# EAGLE design ANA_MCU_CC1310 (EAGLE 8.5.1)
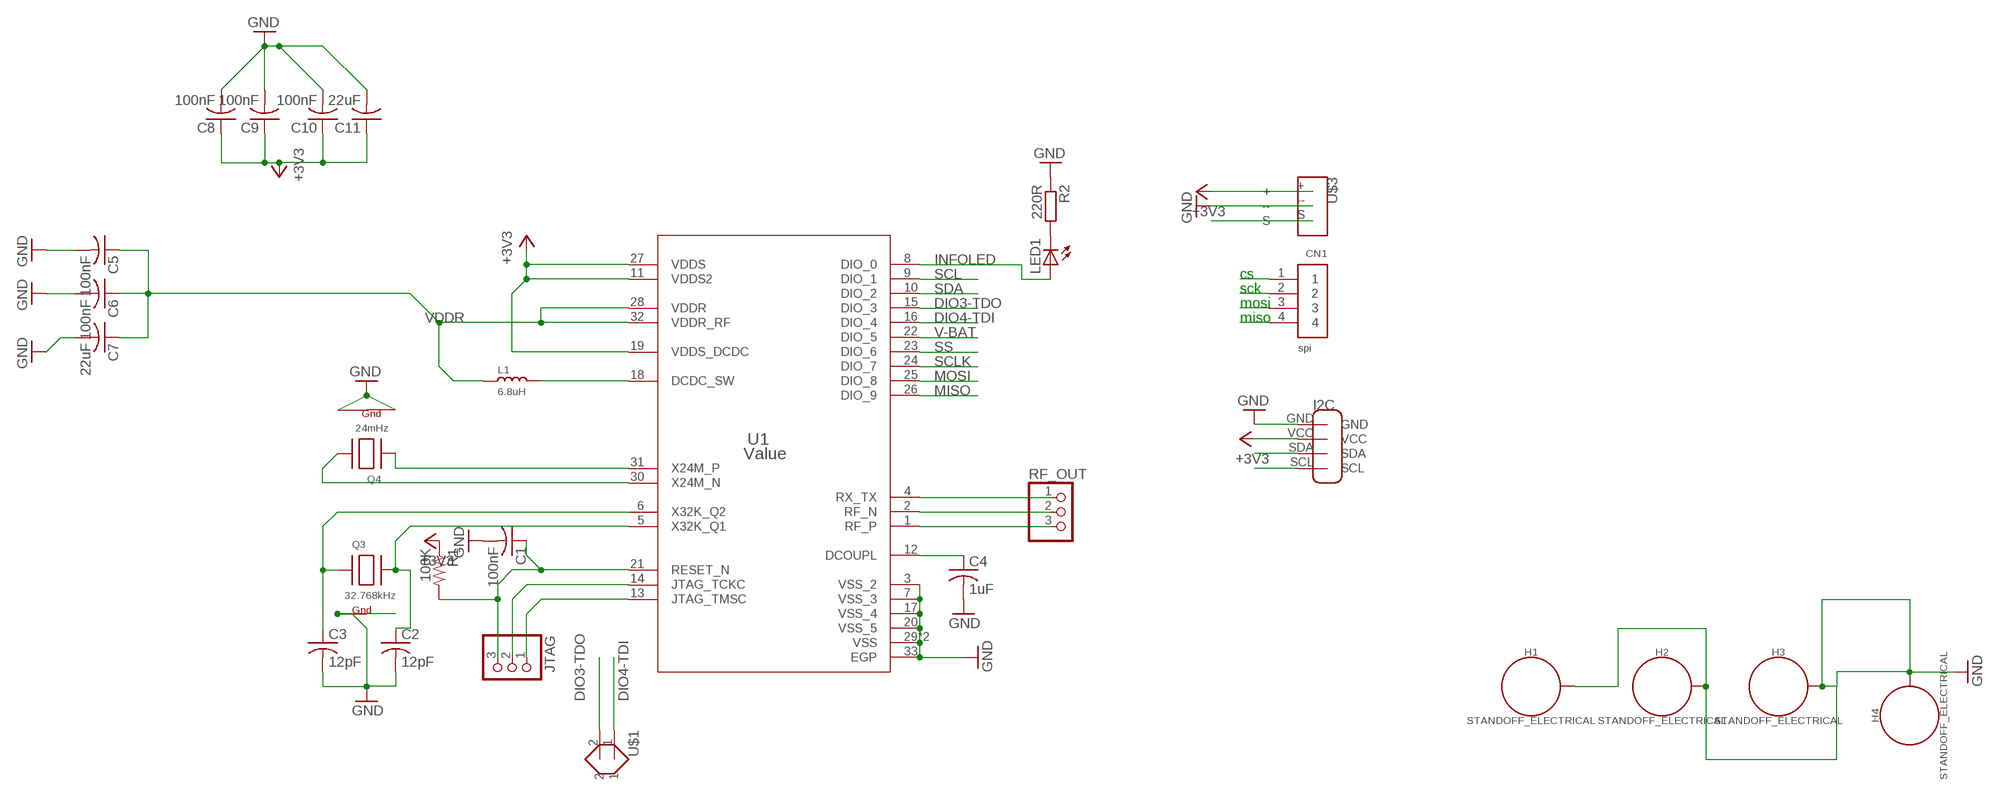
[diagram p0: schematic, sheet 1]

## Parts
C1  100nF  C-USC0805K  [C0805K]
C2  12pF  C-USC0805K  [C0805K]
C3  12pF  C-USC0805K  [C0805K]
C4  1uF  C-USC0805K  [C0805K]
C5  100nF  C-USC0805K  [C0805K]
C6  100nF  C-USC0805K  [C0805K]
C7  22uF  C-USC0805K  [C0805K]
C8  100nF  C-USC0805K  [C0805K]
C9  100nF  C-USC0805K  [C0805K]
C10  100nF  C-USC0805K  [C0805K]
C11  22uF  C-USC0805K  [C0805K]
CN1  spi  1X4-CLEANBIG  [1X04-CLEANBIG]
H1  STANDOFF_ELECTRICAL  [STANDOFF-ELECTRICAL]
H2  STANDOFF_ELECTRICAL  [STANDOFF-ELECTRICAL]
H3  STANDOFF_ELECTRICAL  [STANDOFF-ELECTRICAL]
H4  STANDOFF_ELECTRICAL  [STANDOFF-ELECTRICAL]
JTAG  PINHD-1X3CB  [1X03-CLEANBIG]
L1  6.8uH  SMD-FERRITE-BEAD-330R-1500MA(0805)'0805'  [L0805]
LED1  LEDCHIP-LED0805  [CHIP-LED0805]
Q3  32.768kHz  XTAL-4-3225  [NX3225]
Q4  24mHz  XTAL-4-3225  [NX3225]
R1  100K  R-US_R0805  [R0805]
R2  220R  R-EU_R0805  [R0805]
RF_OUT  PINHD-1X3CB  [1X03-CLEANBIG]
U1  Value  CC1310F128RSMR  [RSM0032B]
U$1  DCMOTOR  [DCMOTOR]
U$2  I2C  [I2C]
U$3  3PINSENSOR  [3PINSENSOR]

## Nets
+3V3: C8.1 C9.1 C10.1 C11.1 R1.1 U1.11(VDDS2) U1.19(VDDS_DCDC) U1.27(VDDS) U$2.VCC U$3.+
DIO3-TDO: U1.15(DIO_3) U$1.2
DIO4-TDI: U1.16(DIO_4) U$1.1
GND: C1.2 C2.2 C3.2 C4.2 C5.2 C6.2 C7.2 C8.2 C9.2 C10.2 C11.2 H1.P1 H2.P1 H3.P1 H4.P1 Q3.2(G2) Q3.4(G1) Q4.2(G2) Q4.4(G1) R2.1 U1.3(VSS_2) U1.7(VSS_3) U1.17(VSS_4) U1.20(VSS_5) U1.29(VSS) U1.33(EGP) U1.V(VSS) U$2.GND U$3.--
INFOLED: LED1.A U1.8(DIO_0)
MISO: CN1.4 U1.26(DIO_9)
MOSI: CN1.3 U1.25(DIO_8)
N$1: Q4.3(X2) U1.30(X24M_N)
N$2: C3.1 Q3.1(X1) U1.6(X32K_Q2)
N$3: Q4.1(X1) U1.31(X24M_P)
N$4: LED1.C R2.2
N$6: L1.2 U1.18(DCDC_SW)
N$10: C2.1 Q3.3(X2) U1.5(X32K_Q1)
N$11: C1.1 JTAG.3 R1.2 U1.21(RESET_N)
N$12: JTAG.2 U1.14(JTAG_TCKC)
N$13: JTAG.1 U1.13(JTAG_TMSC)
N$15: C4.1 U1.12(DCOUPL)
N$16: RF_OUT.3 U1.1(RF_P)
N$17: RF_OUT.2 U1.2(RF_N)
N$18: RF_OUT.1 U1.4(RX_TX)
SCL: U1.9(DIO_1) U$2.SCL
SCLK: CN1.2 U1.24(DIO_7)
SDA: U1.10(DIO_2) U$2.SDA
SS: CN1.1 U1.23(DIO_6)
V-BAT: U1.22(DIO_5) U$3.S
VDDR: C5.1 C6.1 C7.1 L1.1 U1.28(VDDR) U1.32(VDDR_RF)

## Notes on the sheet
- cs
- sck
- mosi
- miso

## Library data of the parts
C1-C11 = adafruit:C-US: CAPACITOR, American symbol
CN1 = adafruit:1X4: 4-pin connector
H1-H4 = SparkFun-Hardware:STANDOFF_ELECTRICAL: Stand Off Drill holes with an electrical connection. For example, use these to ground your board to a chassis. Example SparkFun Products Screw - Phillips Head (1/4", 4-40, 10 pack) <https://www.sparkfun.com/products/10453> (PRT-10453) Screw - Phillips Head (1/2", 4-40, 10 pack) <https://www.sparkfun.com/products/10452> (PRT-10452) Screw - Phillips Head (3/4", 4-40, 10 pack) <https://www.sparkfun.com/products/10451> (PRT-10451) Screw - Phillips Head (1", 4-40, 10 pack) <https://www.sparkfun.com/products/10450> (PRT-10450)
JTAG RF_OUT = adafruit:PINHD-1X3: PIN HEADER
L1 = Seeed-Inductor:SMD-FERRITE-BEAD-330R-1500MA(0805): 303030006; MPN: BLM21PG331SN1D; VALUE: 330R-1500MA
LED1 = adafruit:LED: LED OSRAM: - CHIPLED LG R971, LG N971, LY N971, LG Q971, LY Q971, LO R971, LY R971 LH N974, LH R974 LS Q976, LO Q976, LY Q976 LO Q996 - Hyper CHIPLED LW Q18S LB Q993, LB Q99A, LB R99A - SideLED LS A670, LO A670, LY A670, LG A670, LP A670 LB A673, LV A673, LT A673, LW A673 LH A674 LY A675 LS A676, LA A676, LO A676, LY A676, LW A676 LS A679, LY A679, LG A679 - Hyper Micro SIDELED® LS Y876, LA Y876, LO Y876, LY Y876 LT Y87S - SmartLED LW L88C, LW L88S LB L89C, LB L89S, LG L890 LS L89K, LO L89K, LY L89K LS L896, LA L896, LO L896, LY L896 - TOPLED LS T670, LO T670, LY T670, LG T670, LP T670 LSG T670, LSP T670, LSY T670, LOP T670, LYG T670 LG T671, LOG T671, LSG T671 LB T673, LV T673, LT T673, LW T673 LH T674 LS T676, LA T676, LO T676, LY T676, LB T676, LH T676, LSB T676, LW T676 LB T67C, LV T67C, LT T67C, LS T67K, LO T67K, LY T67K, LW E67C LS E67B, LA E67B, LO E67B, LY E67B, LB E67C, LV E67C, LT E67C LW T67C LS T679, LY T679, LG T679 LS T770, LO T770, LY T770, LG T770, LP T770 LB T773, LV T773, LT T773, LW T773 LH T774 LS E675, LA E675, LY E675, LS T675 LS T776, LA T776, LO T776, LY T776, LB T776 LHGB T686 LT T68C, LB T68C - Hyper Mini TOPLED® LB M676 - Mini TOPLED Santana® LG M470 LS M47K, LO M47K, LY M47K Source: http://www.osram.convergy.de/
Q3 Q4 = adafruit:XTAL-4: Classic 4-pin 3.2 x 2.5mm crystal
R1 = adafruit:R-US_: RESISTOR, American symbol
R2 = resistor:R-EU_: RESISTOR, European symbol
U1 = cc1310_4x4mm:CC1310F128RSMR; ALTERNATEPARTNUMBER: CC1310F128RSMT; APPLICATION_BUILDNUMBER: *; COMPTYPE: IC; MANUFACTURER: Texas Instruments; MOUNTTYPE: SMT; PACKAGEREFERENCE: RSM0032B; PARTNUMBER: CC1310F128RSMR; PIN_COUNT: 33; REFDES: RefDes; TYPE: TYPE
U$1 = 0000000111111aaa:DCMOTOR
U$2 = 0000000111111aaa:I2C
U$3 = 0000000111111aaa:3PINSENSOR

## Board
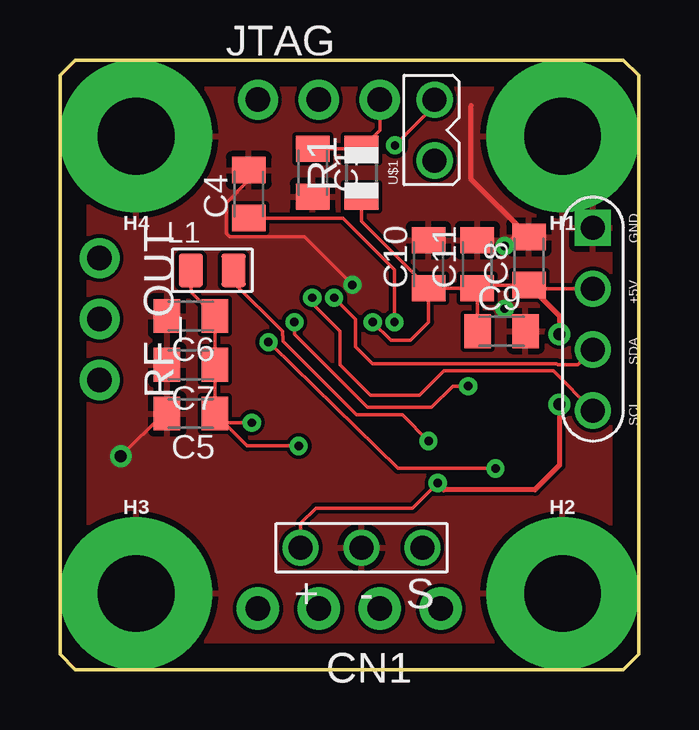
[diagram p1: board, top side]
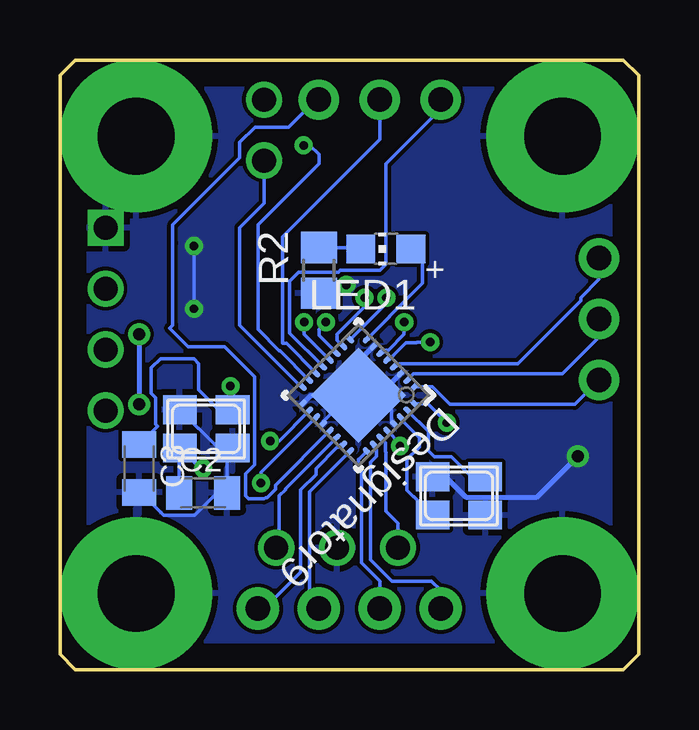
[diagram p2: board, bottom side, seen from below]

Size 24.13 x 25.4 mm. Coordinates in mm from the lower left corner, seen from the top.
Outline: 0.63,25.4 23.49,25.4 24.13,24.77 24.13,0.63 23.49,0 0.63,0 0,0.63 0,24.77 0.63,25.4
Copper layers (1*16): Top 0.035mm / dielectric 1.5mm / Bottom 0.035mm
Design rules "default": minimum track width 6mil, minimum drill 0.35mm, track to track 6mil, track to pad 6mil, pad to pad 6mil, via to via 6mil, smd to smd 6mil, copper to edge 40mil, drill to drill 6mil, minimum pad ring 10mil, minimum via ring 8mil, stop-mask expansion 4mil, vias tented up to drill 0mil, thermal gap 10mil

### Footprints (pad centres in the part's own frame; a part is rotated, then mirrored left to right if it is on the bottom)
C0805K = smd 1.1 x 1.4: 1 -1,0; 2 1,0
1X04-CLEANBIG = drill 1.016 pad 1.778: 1 -3.81,0; 2 -1.27,0; 3 1.27,0; 4 3.81,0
STANDOFF-ELECTRICAL = drill 3.2 pad 6.35: P1 0,0
1X03-CLEANBIG = drill 1.016 pad 1.676: 1 -2.54,0; 2 0,0; 3 2.54,0
L0805 = smd 1.016 x 1.397: 1 -0.889,0; 2 0.889,0
CHIP-LED0805 = smd 1.2 x 1.2: A 0,-1.05; C 0,1.05
NX3225 = smd 1.4 x 1.2: 1 -1.1,-0.8; 2 1.1,-0.8; 3 1.1,0.8; 4 -1.1,0.8
R0805 = smd 1.1 x 1.4: 1 -1,0; 2 1,0
R0805' = smd 1.3 x 1.5: 1 -0.95,0; 2 0.95,0
RSM0032B = smd 0.4 x 0.2: 1 -1.9,1.4; 2 -1.9,1; 3 -1.9,0.6; 4 -1.9,0.2; 5 -1.9,-0.2; 6 -1.9,-0.6; 7 -1.9,-1; 8 -1.9,-1.4; 17 1.9,-1.4; 18 1.9,-1; 19 1.9,-0.6; 20 1.9,-0.2; 21 1.9,0.2; 22 1.9,0.6; 23 1.9,1; 24 1.9,1.4 | smd 0.2 x 0.4: 9 -1.4,-1.9; 10 -1,-1.9; 11 -0.6,-1.9; 12 -0.2,-1.9; 13 0.2,-1.9; 14 0.6,-1.9; 15 1,-1.9; 16 1.4,-1.9; 25 1.4,1.9; 26 1,1.9; 27 0.6,1.9; 28 0.2,1.9; 29 -0.2,1.9; 30 -0.6,1.9; 31 -1,1.9; 32 -1.4,1.9 | smd 2.8 x 2.8: 33 0,0 | smd 0.5 x 0.5: V 0,-1.15
DCMOTOR = drill 1: 1 -2.54,0; 2 0,0
I2C = drill 1 square: GND -2.54,0 | drill 1: SCL 5.08,0; SDA 2.54,0; VCC 0,0
3PINSENSOR = drill 1: + 2.54,0; -- 0,0; S -2.54,0

### Placement (x,y rotation side)
C1  10.54,20.7 270 top
C2  18.16,7.37 0 bottom
C3  20.83,8.38 270 bottom
C4  7.87,19.81 90 top
C5  5.46,10.67 180 top
C6  5.46,14.73 180 top
C7  5.46,12.7 180 top
C8  19.56,17.02 90 top
C9  18.41,14.1 0 top
C10  15.37,16.89 90 top
C11  17.4,16.89 90 top
CN1  12.06,2.54 180 top
H1  20.95,22.23 180 top
H2  20.95,3.17 0 top
H3  3.17,3.17 0 top
H4  3.17,22.23 180 top
JTAG  10.8,23.75 0 top
L1  6.35,16.64 0 top
LED1  10.54,17.53 90 bottom
Q3  18.03,10.03 180 bottom
Q4  7.49,7.24 180 bottom
R1  12.57,20.7 90 top
R2  220R  [R0805']  13.34,16.64 90 bottom
RF_OUT  1.65,14.6 270 top
U1  11.68,11.43 225 bottom
U$1  15.62,23.75 90 top
U$2  22.23,15.88 270 top
U$3  12.57,5.08 180 top

### Tracks (layer width: path | path; a pad name or v marks a point on that pad's centre or on a via)
+3V3  (via drill 0.35, 0.5)
  Top 0.152: v15.75,7.77 15.73,7.76 14.7,6.73 10.67,6.73 10.03,6.1 U$3.+ | v13.04,14.48 13.8,13.72 14.6,13.72 15.37,14.48 15.37,15.75 | 15.37,15.75 C10.1 12.57,18.69 R1.1 | U$2.VCC 19.7,15.88 C8.1 17.53,16.02 C11.1 | C9.1 17.41,15.88 C11.1 | C11.1 15.51,15.89 15.37,15.75
  Top 0.203: C8.1 20.83,14.75 v20.83,13.97 | v20.83,11.05 20.83,8.51 19.81,7.49 16,7.49 15.73,7.76
  Bottom 0.152: U1.19 15.75,8.21 v15.75,7.77 | U1.11 13.34,13.93 13.34,14.18 v13.04,14.48 | U1.27 10.56,9.46 10.56,9.07 10.54,9.05 10.54,6.6 10.03,6.1 U$3.+
  Bottom 0.203: v20.83,13.97 v20.83,11.05
DIO3-TDO  (via drill 0.35)
  Top 0.152: v13.97,21.84 15.62,23.49 U$1.2
  Bottom 0.152: U1.15 14.95,13.28 14.98,13.28 15.88,14.17 15.88,18.54 13.34,21.08 13.34,21.46 13.72,21.84 v13.97,21.84
DIO4-TDI
  Bottom 0.152: U$1.1 15.62,19.43 16.64,18.41 16.64,14.35 14.07,11.78 U1.16
GND  (via drill 0.35, 0.5)
  Top 0.152: v2.54,8.89 4.32,10.67 C5.2 | C4.2 7.87,20.38 6.95,19.46 6.95,18.17 7.08,18.03 10.19,18.03 v12.2,16.03 | C9.2 19.41,14.16 v18.54,15.03 | v18.54,17.65 18.98,18.09 19.49,18.09
  Top 0.203: C8.2 19.49,18.09 17.15,20.43 17.15,23.49
  Bottom 0.152: C3.2 20.75,7.38 19.81,6.44 18.52,6.44 17.59,7.37 C2.2 17.16,9.01 Q3.4 17.51,9.23 18.34,10.06 18.36,10.06 Q3.2 | R2.1 12.99,16.03 v12.2,16.03 | v18.54,15.03 v18.54,17.65 | U1.29 10.2,10.28 10.32,10.39 10.32,10.82 11.05,11.56 | U1.20 13.17,10.33 12.06,11.43 | 12.06,11.43
  Bottom 0.203: U1.7 11.43,13.1 11.43,11.68 11.56,11.56 | 11.56,11.56 U1.33 12.06,11.43 13.66,11.43 U1.17 | U1.3 10.71,11.56 11.05,11.56 11.56,11.56 | Q4.2 8.05,8.04 7.2,7.19 4.24,7.19 v2.54,8.89
  pour Bottom: 0,24.77 0.63,25.4 23.49,25.4 24.13,24.77 24.13,0.63 23.49,0 0.63,0 0,0.63
  pour Top: 0,24.77 0.63,25.4 23.49,25.4 24.13,24.77 24.13,0.63 23.49,0 0.63,0 0,0.63
INFOLED
  Bottom 0.152: U1.8 10.39,14.71 10.39,14.73 9.02,16.1 9.02,17.05 LED1.A
MISO
  Bottom 0.152: CN1.4 8.26,3.3 8.64,3.68 10.29,3.68 11.18,4.57 11.18,8.64 10.93,8.88 10.93,9.16 11.05,9.28 U1.26
MOSI
  Bottom 0.152: CN1.3 10.8,3.68 11.56,4.45 11.56,8.38 11.68,8.51 11.68,8.76 11.66,8.76 U1.25
N$1
  Bottom 0.152: Q4.3 9.36,7.21 9.39,7.21 9.65,7.48 9.65,8.76 9.14,9.27 9.14,9.65 9.92,10.42 U1.30
N$2  (via drill 0.35)
  Top 0.152: v17.02,11.81 16.38,11.81 15.49,10.92 12.83,10.92 9.78,13.97 v9.78,14.48
  Bottom 0.152: v17.02,11.81 16.76,11 Q3.1 17.51,10.83 18.26,11.58 18.34,11.66 18.34,12.75 18.54,12.95 19.94,12.95 20.32,12.57 20.32,11.51 20.15,11.33 20.15,10.23 20.06,10.15 C3.1 | U1.6 10.66,13.2 10.55,13.31 10.44,13.31 9.78,13.97 v9.78,14.48
N$3
  Bottom 0.152: U1.31 8.76,9.92 8.76,9.12 8.51,8.87 7.8,8.87 6.97,8.04 Q4.1
N$4
  Bottom 0.152: LED1.C 11.65,17.59 R2.2
N$6  (via drill 0.35)
  Top 0.152: v15.37,9.52 14.27,10.62 12.37,10.62 9.3,13.69 9.3,13.9 9.27,13.92 9.27,14.1 7.24,16.13 L1.2
  Bottom 0.152: U1.18 15,9.52 v15.37,9.52
N$10  (via drill 0.35)
  Top 0.152: v18.16,8.38 14.1,8.38 8.83,13.52 v8.69,13.65
  Bottom 0.152: v18.16,8.38 18.28,8.38 Q3.3 19.16,9.21 C2.1 | v8.69,13.65 9.25,13.65 9.27,13.62 9.7,13.62 10.38,12.94 10.38,12.91 | 10.26,13.03 10.38,12.91 | 10.38,12.91 U1.5
N$11
  Top 0.152: JTAG.3 13.34,22.46 R1.2 C1.1
  Bottom 0.152: U1.21 15.14,7.69 15.14,7.52 15.5,7.17 15.56,7.17 15.62,7.11 16.26,7.11 16.38,7.24 16.38,8.16 16.01,8.54 16.01,12.2 17.27,13.46 18.8,13.46 19.56,14.22 19.43,14.35 19.43,17.78 19.43,18.54 16.64,21.34 16.64,21.97 16,22.61 14.6,22.61 13.46,23.75 JTAG.3
N$12
  Bottom 0.152: JTAG.2 10.8,22.1 14.86,18.03 14.86,13.59 14.69,13.59 U1.14
N$13
  Bottom 0.152: U1.13 14.55,14.02 14.55,16.19 14.18,16.57 12.52,16.57 12.45,16.64 10.8,16.64 10.54,16.89 10.54,21.08 8.26,23.37 JTAG.1
N$15  (via drill 0.35)
  Top 0.152: v13.95,14.48 13.95,16.66 11.8,18.81 C4.1
  Bottom 0.152: U1.12 13.95,13.98 v13.95,14.48
N$16
  Bottom 0.152: RF_OUT.3 2.67,11.05 7.87,11.05 8.61,11.78 U1.1
N$17
  Bottom 0.152: U1.2 9.38,12.32 3.17,12.32 1.65,13.84 RF_OUT.2
N$18
  Bottom 0.152: RF_OUT.1 1.65,16.26 2.41,15.49 2.41,15.37 5.03,12.75 9.98,12.75 10.1,12.63 U1.4
SCL  (via drill 0.35)
  Top 0.152: U$2.SCL 20.57,12.45 16,12.45 14.99,11.43 12.95,11.43 11.68,12.7 11.68,14.1 10.54,15.24 10.54,15.49 v10.52,15.49
  Bottom 0.152: U1.9 12.02,13.76 10.54,15.24 10.54,15.37 10.54,15.47 | 10.54,15.47 10.54,15.49 | v10.52,15.49 10.54,15.47
SCLK
  Bottom 0.152: U1.24 13.72,7.42 13.72,2.92 CN1.2
SDA  (via drill 0.35)
  Top 0.152: U$2.SDA 21.59,12.7 20.75,12.7 20.7,12.75 13.03,12.75 12.32,13.46 12.32,14.6 v11.43,15.49
  Bottom 0.152: U1.10 12.57,13.73 12.57,13.97 11.43,15.11 v11.43,15.49
SS
  Bottom 0.152: CN1.1 15.62,2.54 14.1,4.06 14.1,7.49 13.46,8.13 13.46,8.37 12.57,9.26 12.54,9.26 12.42,9.38 U1.23
V-BAT
  Bottom 0.152: U1.22 14.73,7.53 14.73,7.49 14.99,7.24 14.99,5.21 U$3.S
VDDR  (via drill 0.35)
  Top 0.152: v9.95,9.32 7.81,9.32 6.84,10.29 | v8,10.29 6.84,10.29 | 6.84,10.29 C5.1 C7.1 C6.1 5.46,15.73 L1.1
  Bottom 0.152: U1.28 9.95,9.42 v9.95,9.32 | U1.32 8.79,11.08 v8,10.29